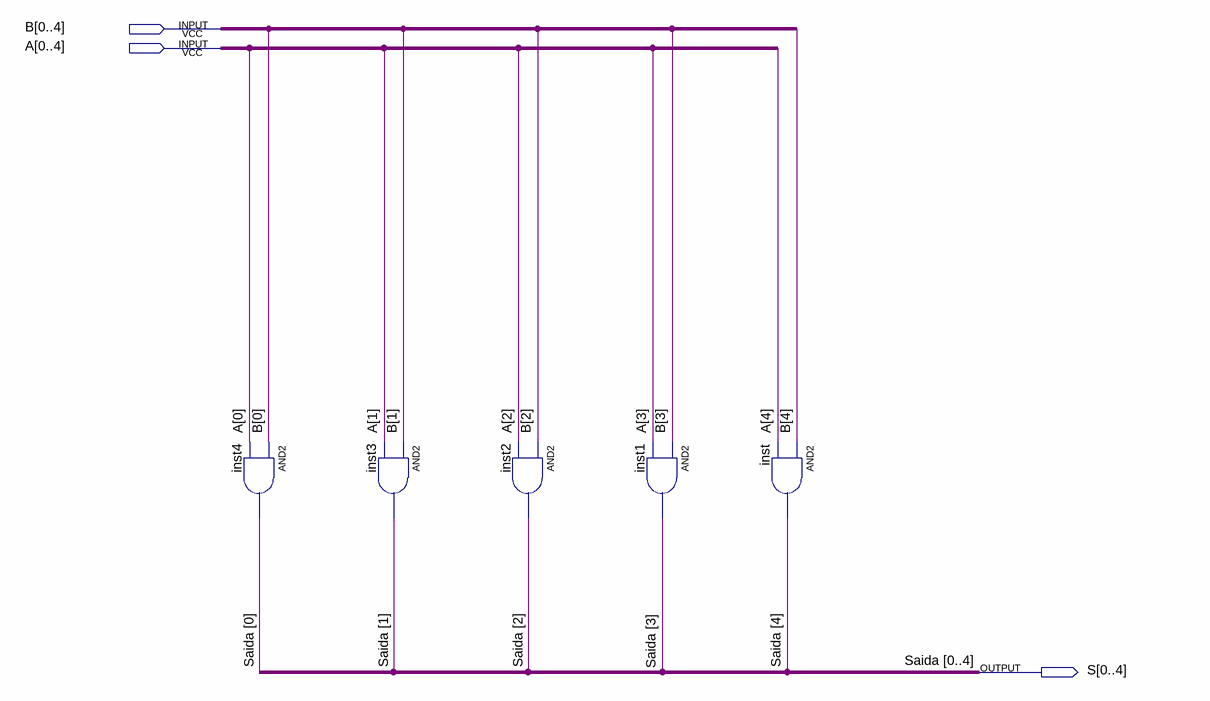
[diagram p0: schematic sheet]
// Quartus schematic AandB.bdf as structural Verilog: 5 symbols, 3 pins
module AandB (
  input  [0:4] B,
  input  [0:4] A,
  output [0:4] S
);

  and inst4 (S[0], B[0], A[0]);
  and inst3 (S[1], B[1], A[1]);
  and inst2 (S[2], B[2], A[2]);
  and inst1 (S[3], B[3], A[3]);
  and inst (S[4], B[4], A[4]);

  // Other names for the same wires on the sheet: Saida[4:0] = {S[4], S[3], S[2], S[1], S[0]}
endmodule
